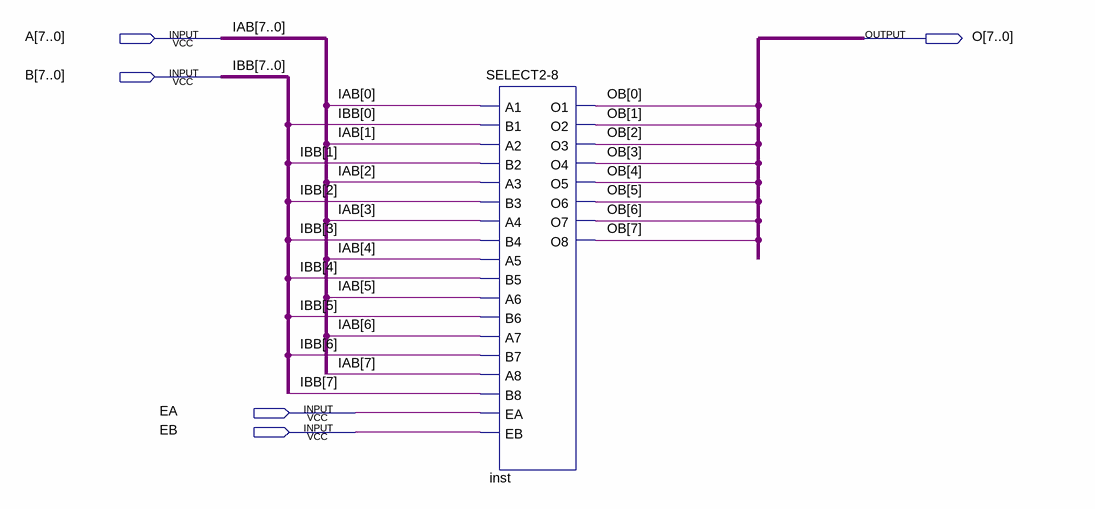
[diagram p0: schematic sheet]
// Quartus schematic SELECT2-8-B.bdf as structural Verilog: 1 symbols, 5 pins
module \SELECT2-8-B  (
  input  [7:0] A,
  input  [7:0] B,
  input  EA,
  input  EB,
  output [7:0] O
);

  wire [7:0] OB;

  \SELECT2-8  inst (
    .A1(A[0]), .B1(B[0]), .A2(A[1]), .B2(B[1]), .A3(A[2]), .B3(B[2]), .A4(A[3]), .B4(B[3]), .A5(A[4]),
    .B5(B[4]), .A6(A[5]), .B6(B[5]), .A7(A[6]), .B7(B[6]), .A8(A[7]), .B8(B[7]), .EA(EA), .EB(EB),
    .O1(OB[0]), .O2(OB[1]), .O3(OB[2]), .O4(OB[3]), .O5(OB[4]), .O6(OB[5]), .O7(OB[6]), .O8(OB[7]));

  // Other names for the same wires on the sheet: IAB[7:0] = A; IBB[7:0] = B
endmodule
